# EAGLE design H-Bridge V.1b (EAGLE 5.06)
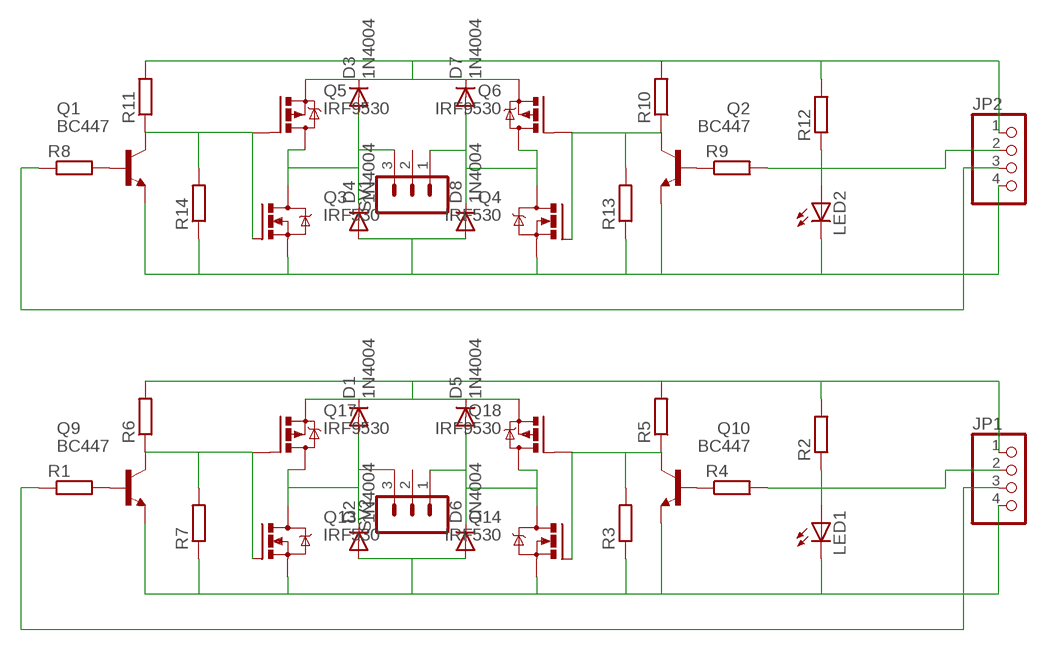
[diagram p0: schematic, sheet 1]

## Parts
D1  1N4004  [DO41-10]
D2  1N4004  [DO41-10]
D3  1N4004  [DO41-10]
D4  1N4004  [DO41-10]
D5  1N4004  [DO41-10]
D6  1N4004  [DO41-10]
D7  1N4004  [DO41-10]
D8  1N4004  [DO41-10]
JP1  PINHD-1X4  [1X04]
JP2  PINHD-1X4  [1X04]
LED1  LED3MM  [LED3MM]
LED2  LED3MM  [LED3MM]
Q1  BC447  [TO92-EBC]
Q2  BC447  [TO92-EBC]
Q3  IRF530  [TO220BV]
Q4  IRF530  [TO220BV]
Q5  IRF9530  [TO220BV]
Q6  IRF9530  [TO220BV]
Q9  BC447  [TO92-EBC]
Q10  BC447  [TO92-EBC]
Q13  IRF530  [TO220BV]
Q14  IRF530  [TO220BV]
Q17  IRF9530  [TO220BV]
Q18  IRF9530  [TO220BV]
R1  R-EU_0207/10  [0207/10]
R2  R-EU_0204/5  [0204/5]
R3  R-EU_0204/7  [0204/7]
R4  R-EU_0207/10  [0207/10]
R5  R-EU_0207/10  [0207/10]
R6  R-EU_0207/10  [0207/10]
R7  R-EU_0204/7  [0204/7]
R8  R-EU_0207/10  [0207/10]
R9  R-EU_0207/10  [0207/10]
R10  R-EU_0207/10  [0207/10]
R11  R-EU_0207/10  [0207/10]
R12  R-EU_0204/5  [0204/5]
R13  R-EU_0204/7  [0204/7]
R14  R-EU_0204/7  [0204/7]
SV1  MA03-1  [MA03-1]
SV2  MA03-1  [MA03-1]

## Nets
+12V: D1.C D5.C JP1.1 Q17.S Q18.S R2.2 R5.2 R6.2
+12V1: D3.C D7.C JP2.1 Q5.S Q6.S R10.2 R11.2 R12.2
GND: D2.A D6.A JP1.4 LED1.K(C) Q9.E Q10.E Q13.S Q14.S R3.1 R7.1
GND1: D4.A D8.A JP2.4 LED2.K(C) Q1.E Q2.E Q3.S Q4.S R13.1 R14.1
N$1: Q9.B R1.2
N$2: Q10.B R4.1
N$3: D7.A D8.C Q4.D Q6.D SV1.1
N$5: D3.A D4.C Q3.D Q5.D SV1.3
N$6: Q2.C Q4.G Q6.G R10.1 R13.2
N$7: D5.A D6.C Q14.D Q18.D SV2.1
N$8: D1.A D2.C Q13.D Q17.D SV2.3
N$9: LED1.A R2.1
N$10: Q1.B R8.2
N$11: Q2.B R9.1
N$12: Q10.C Q14.G Q18.G R3.2 R5.1
N$13: Q1.C Q3.G Q5.G R11.1 R14.2
N$14: LED2.A R12.1
N$18: Q9.C Q13.G Q17.G R6.1 R7.2
PWM1: JP1.2 R4.2
PWM2: JP1.3 R1.1
PWM3: JP2.3 R8.1
PWM4: JP2.2 R9.2
Unconnected: SV1.2 SV2.2

## Library data of the parts
D1-D8 = diode:1N4004: DIODE general purpose rectifier, 1 A
JP1 JP2 = pinhead:PINHD-1X4: PIN HEADER
LED1 LED2 = led:LED: LED OSRAM: - CHIPLED LG R971, LG N971, LY N971, LG Q971, LY Q971, LO R971, LY R971 LH N974, LH R974 LS Q976, LO Q976, LY Q976 LO Q996 - Hyper CHIPLED LW Q18S LB Q993, LB Q99A, LB R99A - SideLED LS A670, LO A670, LY A670, LG A670, LP A670 LB A673, LV A673, LT A673, LW A673 LH A674 LY A675 LS A676, LA A676, LO A676, LY A676, LW A676 LS A679, LY A679, LG A679 - Hyper Micro SIDELED® LS Y876, LA Y876, LO Y876, LY Y876 LT Y87S - SmartLED LW L88C, LW L88S LB L89C, LB L89S, LG L890 LS L89K, LO L89K, LY L89K LS L896, LA L896, LO L896, LY L896 - TOPLED LS T670, LO T670, LY T670, LG T670, LP T670 LSG T670, LSP T670, LSY T670, LOP T670, LYG T670 LG T671, LOG T671, LSG T671 LB T673, LV T673, LT T673, LW T673 LH T674 LS T676, LA T676, LO T676, LY T676, LB T676, LH T676, LSB T676, LW T676 LB T67C, LV T67C, LT T67C, LS T67K, LO T67K, LY T67K, LW E67C LS E67B, LA E67B, LO E67B, LY E67B, LB E67C, LV E67C, LT E67C LW T67C LS T679, LY T679, LG T679 LS T770, LO T770, LY T770, LG T770, LP T770 LB T773, LV T773, LT T773, LW T773 LH T774 LS E675, LA E675, LY E675, LS T675 LS T776, LA T776, LO T776, LY T776, LB T776 LHGB T686 LT T68C, LB T68C - Hyper Mini TOPLED® LB M676 - Mini TOPLED Santana® LG M470 LS M47K, LO M47K, LY M47K Source: http://www.osram.convergy.de LUXEON: - LUMILED® LXK2-PW12-R00, LXK2-PW12-S00, LXK2-PW14-U00, LXK2-PW14-V00 LXK2-PM12-R00, LXK2-PM12-S00, LXK2-PM14-U00 LXK2-PE12-Q00, LXK2-PE12-R00, LXK2-PE12-S00, LXK2-PE14-T00, LXK2-PE14-U00 LXK2-PB12-K00, LXK2-PB12-L00, LXK2-PB12-M00, LXK2-PB14-N00, LXK2-PB14-P00, LXK2-PB14-Q00 LXK2-PR12-L00, LXK2-PR12-M00, LXK2-PR14-Q00, LXK2-PR14-R00 LXK2-PD12-Q00, LXK2-PD12-R00, LXK2-PD12-S00 LXK2-PH12-R00, LXK2-PH12-S00 LXK2-PL12-P00, LXK2-PL12-Q00, LXK2-PL12-R00 Source: www.luxeon.com KINGBRIGHT: KA-3528ASYC Source: www.kingbright.com
Q1 Q2 Q9 Q10 = transistor-npn:BC447*: NPN Transistor
Q3 Q4 Q13 Q14 = transistor-power:IRF530: HEXFET Power MOSFET
Q5 Q6 Q17 Q18 = transistor-power:IRF9530: P-CHANNEL HEXFET POWER-MOS-FET Source: http://www.irf.com/product-info/datasheets/data/irf9530.pdf
R1-R14 = resistor:R-EU_: RESISTOR, European symbol
SV1 SV2 = con-lstb:MA03-1: PIN HEADER

## Board
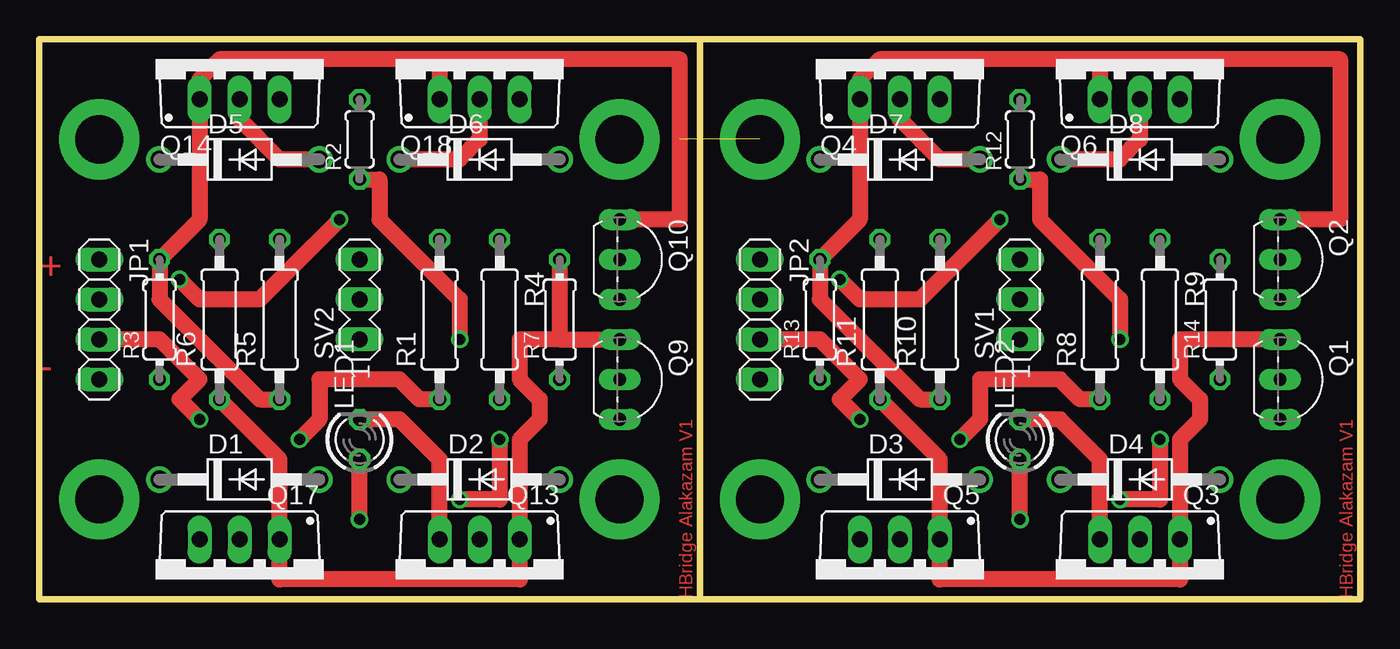
[diagram p1: board, top side]
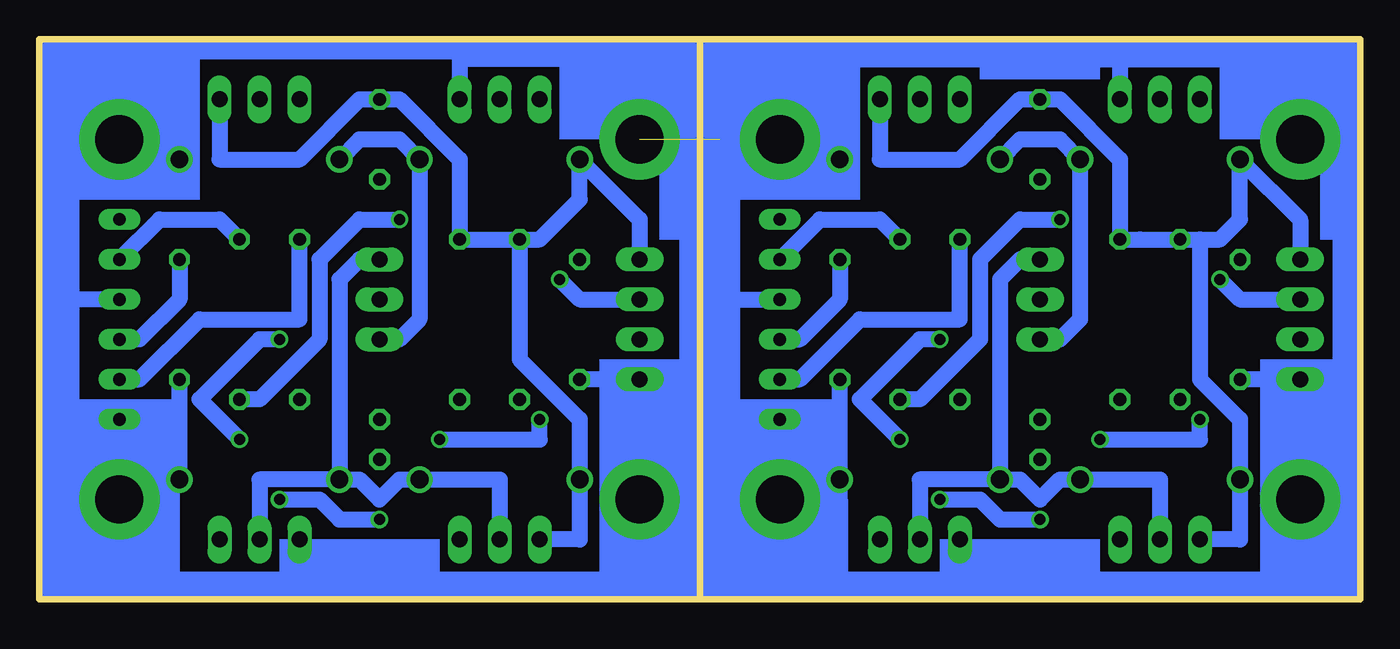
[diagram p2: board, bottom side, seen from below]

Size 83.82 x 35.56 mm. Coordinates in mm from the lower left corner, seen from the top.
Outline: 41.91,35.56 0,35.56 0,0 41.91,0
Outline: 41.91,0 41.91,35.56
Outline: 41.91,0 83.82,0 83.82,35.56 41.91,35.56
Copper layers (1*16): Top 0.035mm / dielectric 1.5mm / Bottom 0.035mm
Design rules "default": minimum track width 10mil, minimum drill 24mil, track to track 8mil, track to pad 8mil, pad to pad 8mil, via to via 8mil, smd to smd 8mil, copper to edge 40mil, drill to drill 8mil, minimum pad ring 10mil, minimum via ring 8mil, stop-mask expansion 4mil, vias tented up to drill 0mil, thermal gap 10mil

### Footprints (pad centres in the part's own frame; a part is rotated, then mirrored left to right if it is on the bottom)
DO41-10 = drill 1.118 round: A 5.08,0; C -5.08,0
1X04 = drill 1.016 long: 1 -3.81,0; 2 -1.27,0; 3 1.27,0; 4 3.81,0
LED3MM = drill 0.813 octagon: A -1.27,0; K 1.27,0
TO92-EBC = drill 0.813 long: B 0,-1.27; C -2.54,-1.27; E 2.54,-1.27
TO220BV = drill 1.016 long: D 0,-2.54; G -2.54,-2.54; S 2.54,-2.54
0207/10 = drill 0.813 octagon: 1 -5.08,0; 2 5.08,0
0204/5 = drill 0.813 octagon: 1 -2.54,0; 2 2.54,0
0204/7 = drill 0.813 octagon: 1 -3.81,0; 2 3.81,0
MA03-1 = drill 1.016 long: 1 -2.54,0; 2 0,0; 3 2.54,0

### Placement (x,y rotation side)
D1  12.7,7.62 0 top
D2  27.94,7.62 0 top
D3  54.61,7.62 0 top
D4  69.85,7.62 0 top
D5  12.7,27.94 0 top
D6  27.94,27.94 0 top
D7  54.61,27.94 0 top
D8  69.85,27.94 0 top
JP1  3.81,17.78 270 top
JP2  45.72,17.78 270 top
LED1  20.32,10.16 90 top
LED2  62.23,10.16 90 top
Q1  80.01,13.97 270 top
Q2  80.01,21.59 270 top
Q3  69.85,1.27 180 top
Q4  54.61,34.29 0 top
Q5  54.61,1.27 180 top
Q6  69.85,34.29 0 top
Q9  38.1,13.97 270 top
Q10  38.1,21.59 270 top
Q13  27.94,1.27 180 top
Q14  12.7,34.29 0 top
Q17  12.7,1.27 180 top
Q18  27.94,34.29 0 top
R1  25.4,17.78 90 top
R2  20.32,29.21 90 top
R3  7.62,17.78 90 top
R4  29.21,17.78 270 top
R5  15.24,17.78 90 top
R6  11.43,17.78 90 top
R7  33.02,17.78 90 top
R8  67.31,17.78 90 top
R9  71.12,17.78 270 top
R10  57.15,17.78 90 top
R11  53.34,17.78 90 top
R12  62.23,29.21 90 top
R13  49.53,17.78 90 top
R14  74.93,17.78 90 top
SV1  62.23,19.05 90 top
SV2  20.32,19.05 90 top

### Tracks (layer width: path | path; a pad name or v marks a point on that pad's centre or on a via)
+12V
  Bottom 1.016: JP1.1 3.81,24.13 D5.C 7.62,24.13 8.89,22.86 10.16,22.86 | 10.16,22.86 R6.2 13.97,22.86 | 13.97,22.86 R5.2 15.24,27.94 19.05,31.75 R2.2 21.59,31.75 25.4,27.94 30.48,27.94 Q18.S | 13.97,22.86 10.16,22.86 | 10.16,22.86 10.16,13.97 7.62,11.43 D1.C 7.62,3.81 Q17.S
+12V1
  Bottom 1.016: R11.2 R10.2 57.15,27.94 60.96,31.75 R12.2 63.5,31.75 67.31,27.94 72.39,27.94 Q6.S | JP2.1 45.72,24.13 D7.C 49.53,25.4 52.07,22.86 R11.2 | R11.2 53.34,15.24 49.53,11.43 D3.C 49.53,3.81 Q5.S
GND  (via drill 3.05 pad 5.08)  (1 unrouted)
  Top 1.016: Q13.S 25.4,8.89 22.86,11.43 LED1.K
  Bottom 1.016: v3.81,6.35 3.81,1.27 25.4,1.27 | JP1.4 v3.81,6.35 | 15.24,34.29 3.81,34.29 v3.81,29.21 1.27,29.21 1.27,13.97 JP1.4 | 15.24,34.29 Q14.S | 15.24,34.29 36.83,34.29 v36.83,29.21 | v36.83,29.21 40.64,29.21 40.64,19.05 | 40.64,19.05 Q10.E | 40.64,19.05 40.64,11.43 Q9.E v36.83,6.35 33.02,6.35 | 33.02,6.35 D2.A R7.1 | 25.4,1.27 Q13.S | 25.4,1.27 33.02,1.27 33.02,6.35 | D6.A 36.83,27.94 v36.83,29.21 | JP1.4 R3.1 | JP1.4 v3.81,6.35
  other vias: 45.72,29.21
GND1
  Top 1.016: LED2.K 64.77,11.43 67.31,8.89 Q3.S
  Bottom 1.016: JP2.4 R13.1 JP2.4 | D8.A 77.47,27.94 78.74,29.21 82.55,29.21 82.55,19.05 | 78.74,6.35 Q1.E | R14.1 D4.A 77.47,7.62 78.74,6.35 | 82.55,19.05 82.55,6.35 78.74,6.35 | 41.91,29.21 41.91,34.29 57.15,34.29 Q4.S | JP2.4 41.91,13.97 41.91,29.21 | 41.91,29.21 45.72,29.21 | JP2.4 45.72,1.27 67.31,1.27 | 78.74,6.35 78.74,1.27 67.31,1.27 | 67.31,1.27 Q3.S | Q2.E 82.55,19.05
N$1
  Bottom 1.016: Q9.B 35.56,13.97 31.75,17.78 25.4,17.78 R1.2
N$2
  Bottom 1.016: Q10.B 34.29,24.13 30.48,24.13 R4.1
N$3
  Top 1.016: Q6.D 69.85,29.21 68.58,27.94 D8.C | D7.A 57.15,27.94 54.61,30.48 Q4.D
  Bottom 1.016: D8.C 63.5,29.21 60.96,29.21 D7.A 59.69,17.78 60.96,16.51 SV1.1
N$5
  Bottom 1.016: Q5.D 54.61,7.62 D3.A 60.96,7.62 62.23,6.35 63.5,7.62 D4.C | D4.C 64.77,20.32 63.5,21.59 SV1.3 | D4.C 69.85,7.62 Q3.D
N$6
  Top 1.016: 67.31,34.29 82.55,34.29 82.55,24.13 Q2.C | 67.31,34.29 53.34,34.29 52.07,33.02 Q4.G 52.07,24.13 R13.2 49.53,19.05 55.88,12.7 R10.1 | 67.31,34.29 Q6.G
N$7
  Top 1.016: Q14.D 12.7,30.48 15.24,27.94 D5.A | Q18.D 27.94,29.21 26.67,27.94 D6.C
  Bottom 1.016: SV2.1 19.05,16.51 17.78,17.78 D5.A 19.05,29.21 21.59,29.21 D6.C
N$8
  Bottom 1.016: Q17.D 12.7,7.62 D1.A 19.05,7.62 20.32,6.35 21.59,7.62 D2.C | D2.C 27.94,7.62 Q13.D | D2.C 22.86,20.32 21.59,21.59 SV2.3
N$9  (via drill 0.7, 0.7 pad 0.3)
  Top 1.016: v26.67,6.35 29.21,6.35 v29.21,10.16 | v26.67,16.51 26.67,19.05 21.59,24.13 21.59,26.67 R2.1 | v20.32,5.08 LED1.A
  Bottom 1.016: v26.67,6.35 24.13,6.35 22.86,5.08 v20.32,5.08 | v29.21,10.16 31.75,12.7 27.94,16.51 v26.67,16.51
N$10
  Bottom 1.016: Q1.B 77.47,13.97 73.66,17.78 67.31,17.78 R8.2
N$11
  Bottom 1.016: Q2.B 76.2,24.13 72.39,24.13 R9.1
N$12
  Top 1.016: R5.1 13.97,12.7 7.62,19.05 R3.2 10.16,24.13 Q14.G 10.16,33.02 11.43,34.29 25.4,34.29 | 25.4,34.29 Q18.G | 25.4,34.29 40.64,34.29 40.64,24.13 Q10.C
N$13
  Top 1.016: R11.1 57.15,8.89 Q5.G 57.15,1.27 72.39,1.27 Q3.G 72.39,10.16 73.66,11.43 73.66,12.7 72.39,13.97 72.39,16.51 Q1.C
  Bottom 1.016: R14.2 74.93,19.05 77.47,16.51 Q1.C
N$14  (via drill 0.7 pad 0.3)
  Top 1.016: R12.1 63.5,26.67 63.5,24.13 68.58,19.05 v68.58,16.51 | v71.12,10.16 71.12,6.35 v68.58,6.35 | v62.23,5.08 LED2.A
  Bottom 1.016: v68.58,16.51 69.85,16.51 73.66,12.7 v71.12,10.16 | v68.58,6.35 66.04,6.35 64.77,5.08 v62.23,5.08
N$16  (via drill 3.05 pad 5.08)
  other vias: 45.72,6.35
N$17  (via drill 3.05 pad 5.08)
  other vias: 78.74,6.35
N$18
  Top 1.016: 33.02,16.51 Q9.C | 33.02,16.51 30.48,16.51 30.48,13.97 31.75,12.7 31.75,11.43 30.48,10.16 Q13.G 30.48,1.27 15.24,1.27 Q17.G 15.24,8.89 R6.1 | R7.2 33.02,16.51
  Bottom 1.016: Q9.C 35.56,16.51 33.02,19.05 R7.2
N$19  (via drill 3.05 pad 5.08)
  other vias: 78.74,29.21
PWM1  (via drill 0.7)
  Top 1.016: v19.05,24.13 13.97,19.05 10.16,19.05 v8.89,20.32
  Bottom 1.016: R4.2 27.94,12.7 24.13,16.51 24.13,21.59 21.59,24.13 v19.05,24.13 | v8.89,20.32 7.62,19.05 JP1.2
PWM2  (via drill 0.7, 0.7 pad 0.3)
  Top 1.016: R1.1 24.13,12.7 22.86,13.97 17.78,13.97 17.78,11.43 v16.51,10.16 | v10.16,11.43 8.89,12.7 10.16,13.97 7.62,16.51 JP1.3
  Bottom 1.016: v16.51,10.16 10.16,10.16 v10.16,11.43
PWM3  (via drill 0.7 pad 0.3)
  Top 1.016: R8.1 66.04,12.7 64.77,13.97 59.69,13.97 59.69,11.43 v58.42,10.16 | v52.07,11.43 50.8,12.7 52.07,13.97 49.53,16.51 JP2.3
  Bottom 1.016: v58.42,10.16 52.07,10.16 v52.07,11.43
PWM4  (via drill 0.7 pad 0.3)
  Top 1.016: v60.96,24.13 55.88,19.05 52.07,19.05 v50.8,20.32
  Bottom 1.016: R9.2 69.85,12.7 66.04,16.51 66.04,21.59 63.5,24.13 v60.96,24.13 | JP2.2 49.53,19.05 v50.8,20.32
(copper drawn outside any net)
  shapes: Bottom area x22

### Text on the board
Top: + | - | HBridge Alakazam V1 | HBridge Alakazam V1